# Altium schematic sheet H_BRIDGE_TRANSISTOR.SchDoc
size A4; SheetNumber: 1; SheetTotal: 3
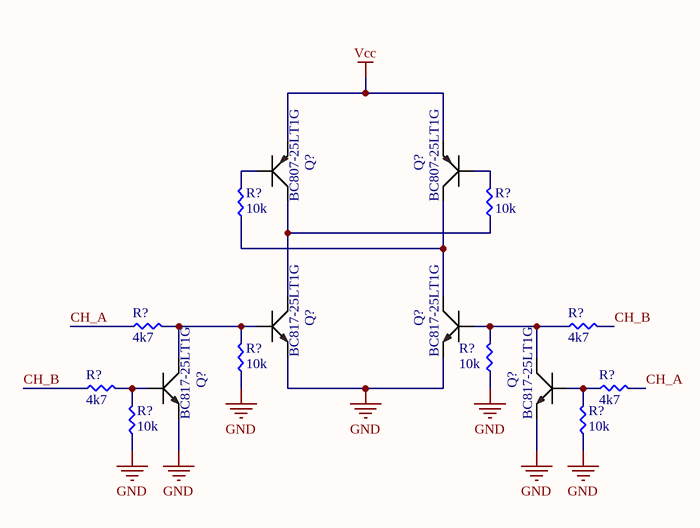
[diagram p0: H_BRIDGE_TRANSISTOR.SchDoc]

## Parts
(Parts that share a designator on the sheet are numbered #1, #2 ... from top to bottom, then left to right.)
Q?#1  BC807-25LT1G  [SOT-23]
Q?#2  BC807-25LT1G  [SOT-23]
Q?#3  BC817-25LT1G  [SOT-23]
Q?#4  BC817-25LT1G  [SOT-23]
Q?#5  BC817-25LT1G  [SOT-23]
Q?#6  BC817-25LT1G  [SOT-23]
R?#1  10k  [R_0603]
R?#2  10k  [R_0603]
R?#3  4k7  [R_0603]
R?#4  4k7  [R_0603]
R?#5  10k  [R_0603]
R?#6  10k  [R_0603]
R?#7  4k7  [R_0603]
R?#8  4k7  [R_0603]
R?#9  10k  [R_0603]
R?#10  10k  [R_0603]

## Nets
GND: Q?#3.3(Emiter) Q?#4.3(Emiter) Q?#5.3(Emiter) Q?#6.3(Emiter) R?#5.1 R?#6.1 R?#9.1 R?#10.1
Vcc: Q?#1.3(Emiter) Q?#2.3(Emiter)
CH_A: R?#3.1 R?#8.2
CH_B: R?#4.2 R?#7.1
NetQ?#1_1: Q?#1.1(Collector) Q?#3.1(Collector) R?#2.1
NetQ?#1_2: Q?#1.2(Base) R?#1.2
NetQ?#2_1: Q?#2.1(Collector) Q?#4.1(Collector) R?#1.1
NetQ?#2_2: Q?#2.2(Base) R?#2.2
NetQ?#3_2: Q?#3.2(Base) Q?#5.1(Collector) R?#3.2 R?#5.2
NetQ?#4_2: Q?#4.2(Base) Q?#6.1(Collector) R?#4.1 R?#6.2
NetQ?#5_2: Q?#5.2(Base) R?#7.2 R?#9.2
NetQ?#6_2: Q?#6.2(Base) R?#8.1 R?#10.2

## Library data of the parts
Q?#1 Q?#2 = BC807-25LT1G: TRANS PNP 45V 0.5A SOT23; Manufacturer: ON Semiconductor; Vce Saturation (Max) @ Ib, Ic: 700mV @ 50mA, 500mA; Current - Collector Cutoff (Max): 100nA (ICBO); DC Current Gain (hFE) (Min) @ Ic, Vce: 160 @ 100mA, 1V; Frequency - Transition: 100MHz; Supplier 1: Digi-Key; Manufacturer Part Number: BC807-25LT1G; RoHS: RoHS Compliant; Category: Discrete Semiconductor Products; Stock 1: 42551; Pricing 1: 1=0.16, 10=0.15, 100=0.0815, 500=0.05018, 1000=0.03421 (USD); Packaging: Cut Tape (CT); Part Status: Active; Transistor Type: PNP; Operating Temperature: -55°C ~ 150°C (TJ); Mounting Type: Surface Mount; Package / Case: TO-236-3, SC-59, SOT-23-3; Supplier Device Package: SOT-23-3 (TO-236); Base Part Number: BC807; ComponentLink1URL: http://www.onsemi.com/pub/Collateral/BC807-16LT1-D.PDF; ComponentLink1Description: http://www.onsemi.com/pub/Collateral/BC807-16LT1-D.PDF; Supplier Part Number 1: BC807-25LT1GOSCT-ND
Q?#3-Q?#6 = BC817-25LT1G: TRANS NPN 45V 0.5A SOT23; Manufacturer: ON Semiconductor; Vce Saturation (Max) @ Ib, Ic: 700mV @ 50mA, 500mA; Current - Collector Cutoff (Max): 100nA (ICBO); DC Current Gain (hFE) (Min) @ Ic, Vce: 160 @ 100mA, 1V; Frequency - Transition: 100MHz; Supplier 1: Digi-Key; Manufacturer Part Number: BC817-25LT1G; RoHS: RoHS Compliant; Category: Discrete Semiconductor Products; Stock 1: 49597; Pricing 1: 1=0.2, 10=0.185, 100=0.101, 500=0.06214, 1000=0.04237 (USD); Packaging: Cut Tape (CT); Part Status: Active; Transistor Type: NPN; Operating Temperature: -65°C ~ 150°C (TJ); Mounting Type: Surface Mount; Package / Case: TO-236-3, SC-59, SOT-23-3; Supplier Device Package: SOT-23-3 (TO-236); Base Part Number: BC817; ComponentLink1URL: http://www.onsemi.com/pub/Collateral/BC817-16LT1-D.PDF; ComponentLink1Description: http://www.onsemi.com/pub/Collateral/BC817-16LT1-D.PDF; Supplier Part Number 1: BC817-25LT1GOSCT-ND
R?#1 R?#2 R?#5 R?#6 R?#9 R?#10 = RC0603JR-0710KL: RES SMD 10K OHM 5% 1/10W 0603; Manufacturer: Yageo; Resistance: 10kR; Voltage Rating (DC): 50V; Temperature Coefficient: 100ppm/°C; Power Rating: 100mW; Number of Elements: 4; Reverse Breakdown Voltage: 6.4V; Element Configuration: Common Anode; Capacitance: 15pF; Operating Supply Voltage: 5V; Max Surge Current: 1.6A; Direction: Unidirectional; Clamping Voltage: 13V; Peak Pulse Power: 20W; Power Line Protection: No; Breakdown Voltage: 6.8V; Leakage Current: 1uA; Test Current: 1mA; Max Breakdown Voltage: 7.1V; ESD Protection: Yes; Supplier 1: Digi-Key; Manufacturer Part Number: RC0603JR-0710KL; Stock 1: 28577574; Pricing 1: 1=0.1, 10=0.02, 100=0.0081, 1000=0.00362, 2500=0.00314 (USD); Case/Package: 0603; Number of Pins: 2; Contact Plating: Matte,Tin; Case Code (Imperial): 0603; Case Code (Metric): 1608; Min Operating Temperature: -55°C; Max Operating Temperature: 155°C; Packaging: Tape and Reel; Tolerance: 5%; Composition: Thick Film; Voltage Rating: 50V; Termination: SMD/SMT; Military Standard: Not; Length: 1.6mm; Width: 0.8mm; Depth: 0.8mm; Radiation Hardening: No; REACH SVHC: Unknown; Lead Free: Lead Free; ComponentLink1URL: http://www.yageo.com/documents/recent/PYu-RC_Group_51_RoHS_L_10.pdf?src-supplier=Digi-Key; ComponentLink1Description: http://www.yageo.com/documents/recent/PYu-RC_Group_51_RoHS_L_10.pdf?src-supplier=Digi-Key; ComponentLink2URL: https://www.verical.com/server-webapp/html/getDatasheet?partID=327958&src-supplier=Verical; ComponentLink2Description: https://www.verical.com/server-webapp/html/getDatasheet?partID=327958&src-supplier=Verical; ComponentLink3URL: http://www.yageo.com/documents/recent/PYu-RC_Group_51_RoHS_L_2.pdf?src-supplier=Avnet; ComponentLink3Description: http://www.yageo.com/documents/recent/PYu-RC_Group_51_RoHS_L_2.pdf?src-supplier=Avnet; ComponentLink4URL: http://www.farnell.com/datasheets/1868787.pdf?src-supplier=Element14; ComponentLink4Description: http://www.farnell.com/datasheets/1868787.pdf?src-supplier=Element14; ComponentLink5URL: http://www.farnell.com/datasheets/443971.pdf?src-supplier=Element14; ComponentLink5Description: http://www.farnell.com/datasheets/443971.pdf?src-supplier=Element14; Supplier Part Number 1: 311-10KGRCT-ND; Supplier 2: Digi-Key; Stock 2: 19; Pricing 2: 1 = 0,35000, 10 = 0,28200, 25 = 0,25800, 100 = 0,16200, 250 = 0,16020, 500 = 0,15000, 1000 = 0,10200 (USD); RoHS: Yes; Package Quantity: 1; Number of Unidirectional Channels: 4; Reverse Standoff Voltage: 5V; Min Breakdown Voltage: 6.4V; Polarity: Unidirectional; Number of Channels: 4; Peak Pulse Current: 1.6A; Power Dissipation: 20W; Max Reverse Leakage Current: 1uA; Number of Lines: 4; Height: 1mm; Halogen Free: Halogen Free; ComponentLink6URL: https://datasheet.ciiva.com/11193/nsqa6v8aw5t2-d-11193200.pdf?src-supplier=Avnet; ComponentLink6Description: https://datasheet.ciiva.com/11193/nsqa6v8aw5t2-d-11193200.pdf?src-supplier=Avnet; ComponentLink7URL: https://datasheet.ciiva.com/15143/getdatasheetpartid-134373-15143649.pdf?src-supplier=Verical; ComponentLink7Description: https://datasheet.ciiva.com/15143/getdatasheetpartid-134373-15143649.pdf?src-supplier=Verical; ComponentLink8URL: https://datasheet.ciiva.com/339/nsqa6v8aw5t2-d-339844.pdf?src-supplier=Digi-Key; ComponentLink8Description: https://datasheet.ciiva.com/339/nsqa6v8aw5t2-d-339844.pdf?src-supplier=Digi-Key; ComponentLink9URL: https://datasheet.ciiva.com/30479/0900766b8127caf9-30479001.pdf?src-supplier=RSComponents; ComponentLink9Description: https://datasheet.ciiva.com/30479/0900766b8127caf9-30479001.pdf?src-supplier=RSComponents; ComponentLink10URL: https://datasheet.ciiva.com/339/nsqa6v8aw5t2-d-339846.pdf?src-supplier=Digi-Key; ComponentLink10Description: https://datasheet.ciiva.com/339/nsqa6v8aw5t2-d-339846.pdf?src-supplier=Digi-Key
R?#3 R?#4 R?#7 R?#8 = RC0603JR-074K7L: RES SMD 4.7K OHM 5% 1/10W 0603; Manufacturer: Yageo; Power (Watts): 0.1W, 1/10W; Temperature Coefficient: ±100ppm/°C; Supplier 1: Digi-Key; Manufacturer Part Number: RC0603JR-074K7L; RoHS: RoHS Compliant; Category: Resistors; Stock 1: 2156468; Pricing 1: 1=0.1, 10=0.025, 100=0.01, 1000=0.00451, 2500=0.00392 (USD); Packaging: Cut Tape (CT); Part Status: Active; Tolerance: ±5%; Composition: Thick Film; Features: Moisture Resistant; Operating Temperature: -55°C ~ 155°C; Package / Case: 0603 (1608 Metric); Supplier Device Package: 0603; Size / Dimension: 0.063" L x 0.032" W (1.60mm x 0.80mm); Height - Seated (Max): 0.022" (0.55mm); Failure Rate: -; ComponentLink1URL: http://www.yageo.com/documents/recent/PYu-RC_Group_51_RoHS_L_9.pdf; ComponentLink1Description: http://www.yageo.com/documents/recent/PYu-RC_Group_51_RoHS_L_9.pdf; Supplier Part Number 1: 311-4.7KGRCT-ND